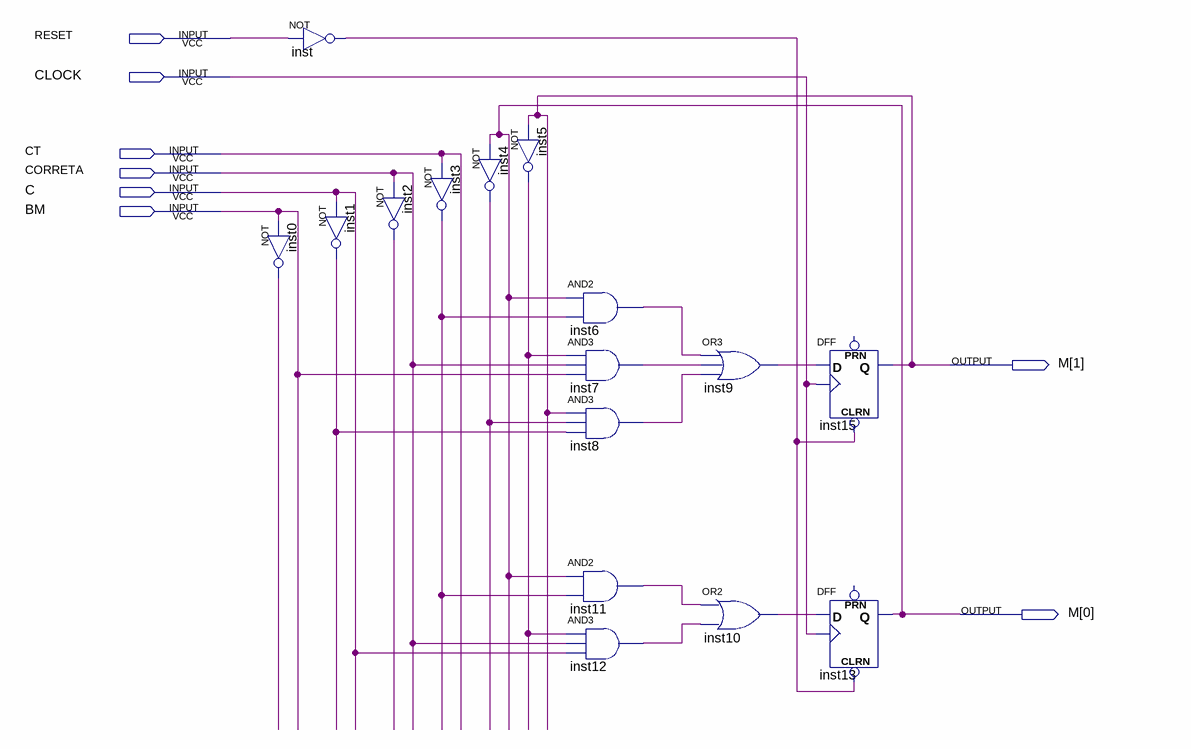
[diagram p0: schematic sheet]
// Quartus schematic Operacao.bdf as structural Verilog: 16 symbols, 8 pins
module Operacao (
  input  RESET,
  input  CLOCK,
  input  CT,
  input  CORRETA,
  input  C,
  input  BM,
  output [1:0] M
);

  wire inst0_out, inst1_out, inst2_out, inst3_out, inst4_out, inst5_out, inst6_out, inst7_out, inst8_out,
       inst9_out, inst10_out, inst11_out, inst12_out, inst_out;

  not inst (inst_out, RESET);
  not inst0 (inst0_out, BM);
  not inst1 (inst1_out, C);
  not inst3 (inst3_out, CT);
  not inst2 (inst2_out, CORRETA);
  not inst5 (inst5_out, M[1]);
  not inst4 (inst4_out, M[0]);
  and inst6 (inst6_out, M[0], inst3_out);
  and inst7 (inst7_out, inst5_out, CORRETA, BM);
  and inst8 (inst8_out, M[1], inst4_out, inst1_out);
  and inst11 (inst11_out, M[0], inst3_out);
  and inst12 (inst12_out, inst5_out, CORRETA, C);
  or inst9 (inst9_out, inst6_out, inst7_out, inst8_out);
  or inst10 (inst10_out, inst11_out, inst12_out);
  DFF inst15 (.CLRN(inst_out), .CLK(CLOCK), .D(inst9_out), .Q(M[1]));  // open: PRN
  DFF inst13 (.CLRN(inst_out), .CLK(CLOCK), .D(inst10_out), .Q(M[0]));  // open: PRN
endmodule
